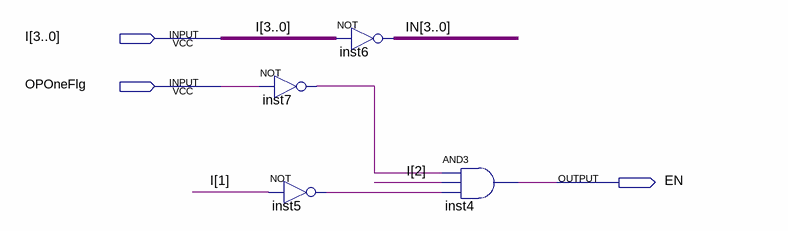
[diagram p0: schematic sheet]
// Quartus schematic EN_RAM.bdf as structural Verilog: 4 symbols, 3 pins
module EN_RAM (
  input  [3:0] I,
  input  OPOneFlg,
  output EN
);

  wire inst5_out, inst7_out;
  wire [3:0] IN;

  not inst7 (inst7_out, OPOneFlg);
  assign IN = ~I;  // NOT inst6, 4 bits wide
  not inst5 (inst5_out, I[1]);
  and inst4 (EN, inst7_out, I[2], inst5_out);
endmodule
